# Altium schematic sheet Connectors.SchDoc
size A3; SheetNumber: 2; SheetTotal: 4
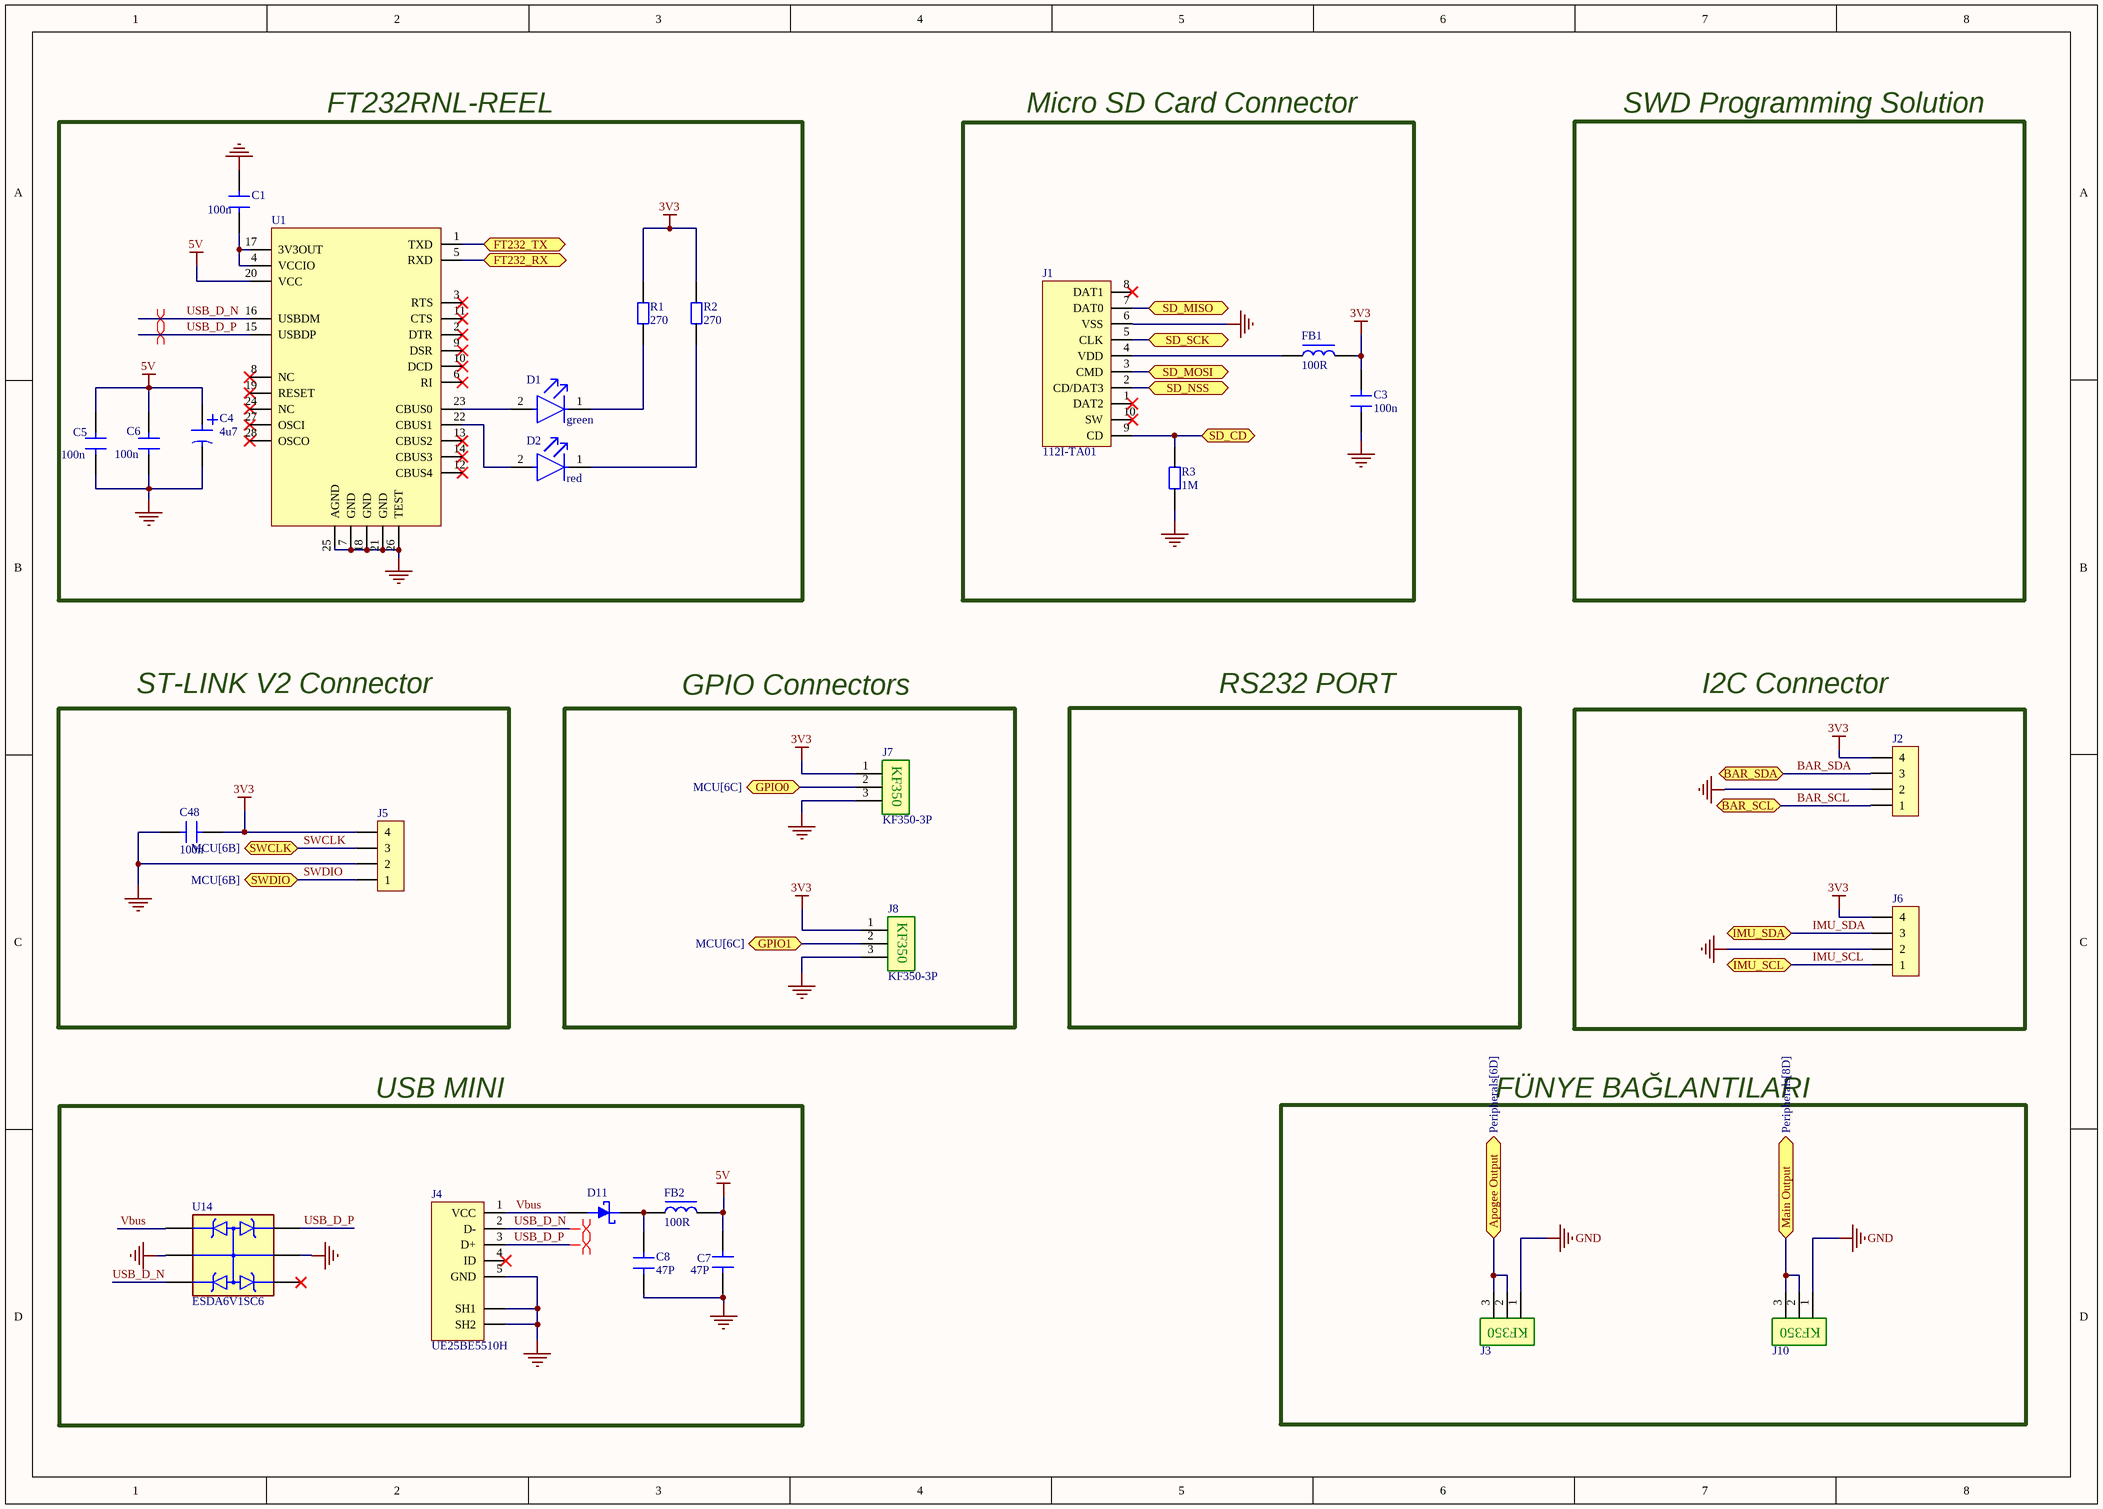
[diagram p0: Connectors.SchDoc]

## Parts
C1  100n  [CAP 0603]
C3  100n  [CAP 0603]
C4  4u7  [865060653010]
C5  100n  [CAP 0603]
C6  100n  [CAP 0603]
C7  47P  [CAP 0805]
C8  47P  [CAP 0805]
C48  100n  [CAP 0603]
D1  green  [FP-LTST-C170GKT-MFG]
D2  red  [FP-LTST-C170GKT-MFG]
D11  1N5819HW-7-F  [1N5819HW-7-F]  (value not drawn)
FB1  100R  [FB 0603]
FB2  100R  [FB 0805]
J1  112I-TA01  [112I-TA01]
J2  1x4 HEADER MALE  [1X4 HEADER MALE]  (value not drawn)
J3  KF350-3P  [KF350-3P]  (value not drawn)
J4  UE25BE5510H  [UE25BE55H]
J5  1x4 HEADER MALE  [1X4 HEADER MALE]  (value not drawn)
J6  1x4 HEADER MALE  [1X4 HEADER MALE]  (value not drawn)
J7  KF350-3P  [KF350-3P]
J8  KF350-3P  [KF350-3P]
J10  KF350-3P  [KF350-3P]  (value not drawn)
R1  270  [RES 0805]
R2  270  [RES 0805]
R3  1M  [RES 0603]
U1  FT232RL-REEL  [FT232RL]  (value not drawn)
U14  ESDA6V1SC6  [ESDA6V1SC6- SOT23]

## Blocks framed on the sheet
FT232RNL-REEL: C1 C4-C6 D1 D2 R1 R2 U1
Micro SD Card Connector: C3 FB1 J1 R3
ST-LINK V2 Connector: C48 J5
I2C Connector: J2 J6
USB MINI: C7 C8 D11 FB2 J4 U14
FÜNYE BAĞLANTILARI: J3 J10

## Ports
Apogee Output (bidir, see Peripherals[6D]), BAR_SCL (bidir, see MCU[6C], Peripherals[6A]), BAR_SDA (bidir, see MCU[6C], Peripherals[6A]), FT232_RX (bidir, see MCU[6C]), FT232_TX (bidir, see MCU[6C]), GPIO0 (bidir, see MCU[6C]), GPIO1 (bidir, see MCU[6C]), IMU_SCL (bidir, see MCU[6B], Peripherals[6B]), IMU_SDA (bidir, see MCU[4C], Peripherals[6B]), Main Output (bidir, see Peripherals[8D]), SD_CD (bidir, see MCU[4C]), SD_MISO (bidir, see MCU[6B]), SD_MOSI (bidir, see MCU[6B]), SD_NSS (bidir, see MCU[6B]), SD_SCK (bidir, see MCU[6B]), SWCLK (bidir, see MCU[6B]), SWDIO (bidir, see MCU[6B])

## Nets
3V3: C3.2 C48.2 FB1.2 J2.4 J5.4 J6.4 J7.1 J8.1 R1.2 R2.2
5V: C4.1(P) C5.2 C6.2 C7.2 FB2.2 U1.20(VCC)
GND: C1.2 C3.1 C4.2(N) C5.1 C6.1 C7.1 C8.1 C48.1 J1.6(VSS) J2.2 J3.1 J4.5(GND) J4.SH1 J4.SH2 J5.2 J6.2 J7.3 J8.3 J10.1 R3.1 U1.7(GND) U1.18(GND) U1.21(GND) U1.25(AGND) U1.26(TEST) U14.2 U14.5
Apogee Output: J3.2 J3.3 ; port Apogee Output
BAR_SCL: J2.1 ; port BAR_SCL
BAR_SDA: J2.3 ; port BAR_SDA
FT232_RX: U1.5(RXD) ; port FT232_RX
FT232_TX: U1.1(TXD) ; port FT232_TX
GPIO0: J7.2 ; port GPIO0
GPIO1: J8.2 ; port GPIO1
IMU_SCL: J6.1 ; port IMU_SCL
IMU_SDA: J6.3 ; port IMU_SDA
Main Output: J10.2 J10.3 ; port Main Output
SD_CD: J1.9(CD) R3.2 ; port SD_CD
SD_MISO: J1.7(DAT0) ; port SD_MISO
SD_MOSI: J1.3(CMD) ; port SD_MOSI
SD_NSS: J1.2(CD/DAT3) ; port SD_NSS
SD_SCK: J1.5(CLK) ; port SD_SCK
SWCLK: J5.3 ; port SWCLK
SWDIO: J5.1 ; port SWDIO
USB_D_N: J4.2(D-) U1.16(USBDM) U14.3
USB_D_P: J4.3(D+) U1.15(USBDP) U14.6
Vbus: D11.C J4.1(VCC) U14.1
NetC1_1: C1.1 U1.4(VCCIO) U1.17(3V3OUT)
NetC8_2: C8.2 D11.A FB2.1
NetD1_1: D1.1(C) R1.1
NetD1_2: D1.2(A) U1.23(CBUS0)
NetD2_1: D2.1(C) R2.1
NetD2_2: D2.2(A) U1.22(CBUS1)
NetFB1_1: FB1.1 J1.4(VDD)

Not connected (* = marked no-connect by the designer): J1 1(DAT2)* 8(DAT1)* 10(SW)*; J4 4(ID)*; U1 2(DTR)* 3(RTS)* 6(RI)* 8(NC)* 9(DSR)* 10(DCD)* 11(CTS)* 12(CBUS4)* 13(CBUS2)* 14(CBUS3)* 19(RESET)* 24(NC)* 27(OSCI)* 28(OSCO)*; U14 4*

## Layout directives
differential pair: USB_D_N, USB_D_P

## Notes on the sheet
- SWD Programming Solution
- GPIO Connectors
- RS232 PORT
- (in symbol KF350-3P) KF350

## Library data of the parts
C1 C3 C5 C6 C48 = CAP 0603 50V: Capacitor SMD 0603 50V
C4 = 865060653010: Aluminum Electrolytic Capacitor, Polarized, Aluminum (wet), 50V, 20% +Tol, 20% -Tol, 100uF, Surface Mount, 3333; Manufacturer: Wurth Electronics; Supplier 1: Farnell; Manufacturer Part Number: 865060653010; RoHS: Yes; Category: Aluminum Electrolytic Capacitors; Stock 1: 176; Pricing 1: 1=0,825, 10=0,63, 50=0,551, 100=0,481, 200=0,427, 500=0,355, 2500=0,348, 5000=0,341 (EUR); ComponentLink1URL: http://www.farnell.com/datasheets/1880078.pdf?src-supplier=Farnell; ComponentLink1Description: http://www.farnell.com/datasheets/1880078.pdf?src-supplier=Farnell; ComponentLink2URL: http://www.farnell.com/datasheets/1880078.pdf?src-supplier=Newark; ComponentLink2Description: http://www.farnell.com/datasheets/1880078.pdf?src-supplier=Newark; ComponentLink3URL: http://www.farnell.com/datasheets/1880078.pdf?src-supplier=Element14; ComponentLink3Description: http://www.farnell.com/datasheets/1880078.pdf?src-supplier=Element14; ComponentLink4URL: https://katalog.we-online.de/pbs/datasheet/865060653010.pdf?src-supplier=Digikey; ComponentLink4Description: https://katalog.we-online.de/pbs/datasheet/865060653010.pdf?src-supplier=Digikey
C7 C8 = CAP 0805 50V: Capacitor SMD 0805 50V
D1 D2 = CMP-1674-00002-6: LED GREEN CLEAR SMD; Dominant Wavelength: 569nm; Lens Style: Diffused; Forward Voltage: 2.1V; Number of Elements: 1; Wavelength: 565nm; Luminous Intensity: 6mcd; Test Current: 10mA; Power Dissipation: 100mW; Reverse Voltage: 5V; Forward Current: 30mA; Viewing Angle: 130°; Lens Color: Colorless; Min Operating Temperature: -55°C; Number of Pins: 2; Max Operating Temperature: 85°C; Color: Green; Radiation Hardening: No; Illumination Color: Green; Case Code (Metric): 2012; Lens Transparency: Clear; Case/Package: 0805; Width: 1.25mm; Case Code (Imperial): 0805; Package Quantity: 1; Height: 1.1mm; Depth: 1.25mm; Length: 2mm; Power Rating: 100mW; Lead Free: Lead Free; Number of LEDs: 1; Packaging: Tape and Reel; Mount: Surface Mount; Voltage: 5V
D11 = 1N5819HW-7-F: Rectifier Diode, Schottky, 1 Phase, 1 Element, 1A, 40V V(RRM), Silicon; Manufacturer: Diodes; Max Reverse Current: 50uA; Peak Non-Repetitive Surge Current: 25A; Forward Voltage: 450mV; Max Power Dissipation: 450mW; Polarity: Standard; Capacitance: 50pF; Supplier 1: Future Electronics; Manufacturer Part Number: 1N5819HW-7-F; RoHS: Yes; Category: Rectifier Diodes; Stock 1: 5079000; Pricing 1: 3000=0,0409, 9000=0,0394, 15000=0,0388, 60000=0,037, 90000=0,0358 (USD); Case/Package: SOD-123-2; Number of Pins: 2; Weight: 0.000353oz; Min Operating Temperature: -65°C; Max Operating Temperature: 125°C; Forward Current: 1A; Max Repetitive Reverse Voltage (Vrrm): 40V; Package Quantity: 3000; Packaging: Tape and Reel; Average Rectified Current: 1A; Max Forward Surge Current (Ifsm): 25A; Termination: SMD/SMT; Voltage Rating (DC): 40V; Current Rating: 1A; Output Current: 1A; Max Reverse Voltage (DC): 40V; Series: -; Reverse Voltage: 40V; Length: 2.85mm; Width: 1.7mm; Height: 1.25mm; Radiation Hardening: No; Reach SVHC Compliant: No; Lead Free: Lead Free; RoHS Compliant: Yes; ComponentLink1URL: https://datasheet.ciiva.com/27092/1538419-27092484.pdf?src-supplier=Jameco; ComponentLink1Description: https://datasheet.ciiva.com/27092/1538419-27092484.pdf?src-supplier=Jameco; ComponentLink2URL: https://datasheet.ciiva.com/16303/ds30217-16303296.pdf?src-supplier=Future+Electronics; ComponentLink2Description: https://datasheet.ciiva.com/16303/ds30217-16303296.pdf?src-supplier=Future+Electronics; ComponentLink3URL: https://datasheet.ciiva.com/1177/ds30217-1177089.pdf?src-supplier=Element14; ComponentLink3Description: https://datasheet.ciiva.com/1177/ds30217-1177089.pdf?src-supplier=Element14; ComponentLink4URL: https://datasheet.ciiva.com/8303/ds30217-8303132.pdf?src-supplier=Avnet; ComponentLink4Description: https://datasheet.ciiva.com/8303/ds30217-8303132.pdf?src-supplier=Avnet; ComponentLink5URL: https://datasheet.ciiva.com/912/ds30217-912802.pdf?src-supplier=Digikey; ComponentLink5Description: https://datasheet.ciiva.com/912/ds30217-912802.pdf?src-supplier=Digikey; ComponentLink6URL: https://datasheet.ciiva.com/912/ds30217-912803.pdf?src-supplier=Digikey; ComponentLink6Description: https://datasheet.ciiva.com/912/ds30217-912803.pdf?src-supplier=Digikey; ComponentLink7URL: https://datasheet.ciiva.com/912/ds30217-912801.pdf?src-supplier=Digikey; ComponentLink7Description: https://datasheet.ciiva.com/912/ds30217-912801.pdf?src-supplier=Digikey
FB1 = FB 0603: Ferrite Bead SMD 0603
FB2 = FB 0805: Ferrite Bead SMD 0805
J1 = 112I-TA01: Micro SD Card Push-Pull 10P (8+2), Switch, Peg, SMD 112I-TA01
J4 = UE25BE5510H: Conn Mini USB 2.0 Type B RCP 5 POS 0.8mm Solder ST Thru-Hole 5 Terminal 1 Port; Manufacturer: Amphenol Commercial; Supplier 1: Arrow Electronics; Manufacturer Part Number: UE25BE5510H; RoHS: Yes; Category: USB Connectors; Stock 1: 16852; Pricing 1: 1=0,4693, 10=0,4507, 25=0,4468, 50=0,4303, 100=0,4157 (USD); ComponentLink1URL: http://www.alliedelec.com/m/d/e7e3d7a920045eebbdef787e60d8b001.pdf?src-supplier=Allied+Electronics; ComponentLink1Description: http://www.alliedelec.com/m/d/e7e3d7a920045eebbdef787e60d8b001.pdf?src-supplier=Allied+Electronics; ComponentLink2URL: https://www.amphenolcanada.com/ProductSearch/drawings/AC/UE25BEX510X.pdf?src-supplier=Digi-Key; ComponentLink2Description: https://www.amphenolcanada.com/ProductSearch/drawings/AC/UE25BEX510X.pdf?src-supplier=Digi-Key; ComponentLink3URL: https://datasheet.octopart.com/UE25-BE55-10H-Amphenol-datasheet-14681365.pdf?src-supplier=Future+Electronics; ComponentLink3Description: https://datasheet.octopart.com/UE25-BE55-10H-Amphenol-datasheet-14681365.pdf?src-supplier=Future+Electronics; ComponentLink4URL: https://datasheet.octopart.com/UE25BE5510H-Amphenol-Communications-Solutions-datasheet-62282189.pdf?src-supplier=Electro+Sonic; ComponentLink4Description: https://datasheet.octopart.com/UE25BE5510H-Amphenol-Communications-Solutions-datasheet-62282189.pdf?src-supplier=Electro+Sonic; Supplier Part Number 1: UE25BE5510H
R1 R2 = RES 0805: Resistor SMD 0805
R3 = RES 0603: Resistor SMD 0603
U1 = FT232RL-REEL: IC USB FS SERIAL UART 28-SSOP; Manufacturer: FTDI; Interface: UART,RS-232,RS-422,RS-485; Data Rate: 12Mbps; Number of Channels: 1; Max Supply Voltage: 5.25V; Min Supply Voltage: 3.3V; Operating Supply Current: 15mA; Voltage: 5V; Supplier 1: Arrow Electronics; Manufacturer Part Number: FT232RL-REEL; RoHS: Yes; Category: Interface ICs; Stock 1: 3812; Pricing 1: 1=4,75, 10=4,3, 50=4,1 (USD); Mount: Surface Mount; Case/Package: SSOP; Number of Pins: 28; Weight: 0.080001oz; Min Operating Temperature: -40°C; Max Operating Temperature: 85°C; Packaging: Tape and Reel; Series: USBmadeEZ-UART; Package Quantity: 1; Number of Transceivers: 1; Length: 10.2mm; Width: 5.3mm; Height: 1.75mm; Radiation Hardening: No; Lead Free: Lead Free; RoHS Compliant: Yes; Reach SVHC Compliant: No; ComponentLink1URL: https://datasheet.ciiva.com/34304/2161019-34304054.pdf?src-supplier=Jameco; ComponentLink1Description: https://datasheet.ciiva.com/34304/2161019-34304054.pdf?src-supplier=Jameco; ComponentLink2URL: https://datasheet.ciiva.com/4787/ds-ft232r-11534-4787658.pdf?src-supplier=Mouser; ComponentLink2Description: https://datasheet.ciiva.com/4787/ds-ft232r-11534-4787658.pdf?src-supplier=Mouser; ComponentLink3URL: https://datasheet.ciiva.com/1787/ds-ft232r-1787048.pdf?src-supplier=Digikey; ComponentLink3Description: https://datasheet.ciiva.com/1787/ds-ft232r-1787048.pdf?src-supplier=Digikey; ComponentLink4URL: https://datasheet.ciiva.com/1787/ds-ft232r-1787047.pdf?src-supplier=Digikey; ComponentLink4Description: https://datasheet.ciiva.com/1787/ds-ft232r-1787047.pdf?src-supplier=Digikey; ComponentLink5URL: https://datasheet.ciiva.com/1787/ds-ft232r-1787049.pdf?src-supplier=Digikey; ComponentLink5Description: https://datasheet.ciiva.com/1787/ds-ft232r-1787049.pdf?src-supplier=Digikey; ComponentLink6URL: https://datasheet.ciiva.com/16200/ds-ft232r-16200652.pdf?src-supplier=Future+Electronics; ComponentLink6Description: https://datasheet.ciiva.com/16200/ds-ft232r-16200652.pdf?src-supplier=Future+Electronics; ComponentLink7URL: https://datasheet.ciiva.com/15150/getdatasheetpartid-643207-15150506.pdf?src-supplier=Verical; ComponentLink7Description: https://datasheet.ciiva.com/15150/getdatasheetpartid-643207-15150506.pdf?src-supplier=Verical
U14 = ESDA6V1SC6: Clamp  Ipp Tvs Diode Surface Mount SOT-23-6                                        Voltage - Reverse Standoff (Typ): 5.25V                                                             Reverse Current: 1mA; MF: STMicroelectronics; Purchase-URL: https://pricing.snapeda.com/search/part/ESDA6V1SC6/?ref=eda; Availability: In Stock; Price: None; SnapEDA_Link: https://www.snapeda.com/parts/ESDA6V1SC6/STMicroelectronics/view-part/?ref=snap; Package: SOT-23-6 STMicroelectronics; Value: *; MP: ESDA6V1SC6; Check_prices: https://www.snapeda.com/parts/ESDA6V1SC6/STMicroelectronics/view-part/?ref=eda